# Altium schematic sheet FishTalk_Schematic.SchDoc
size A4; SheetNumber: 1; SheetTotal: 1
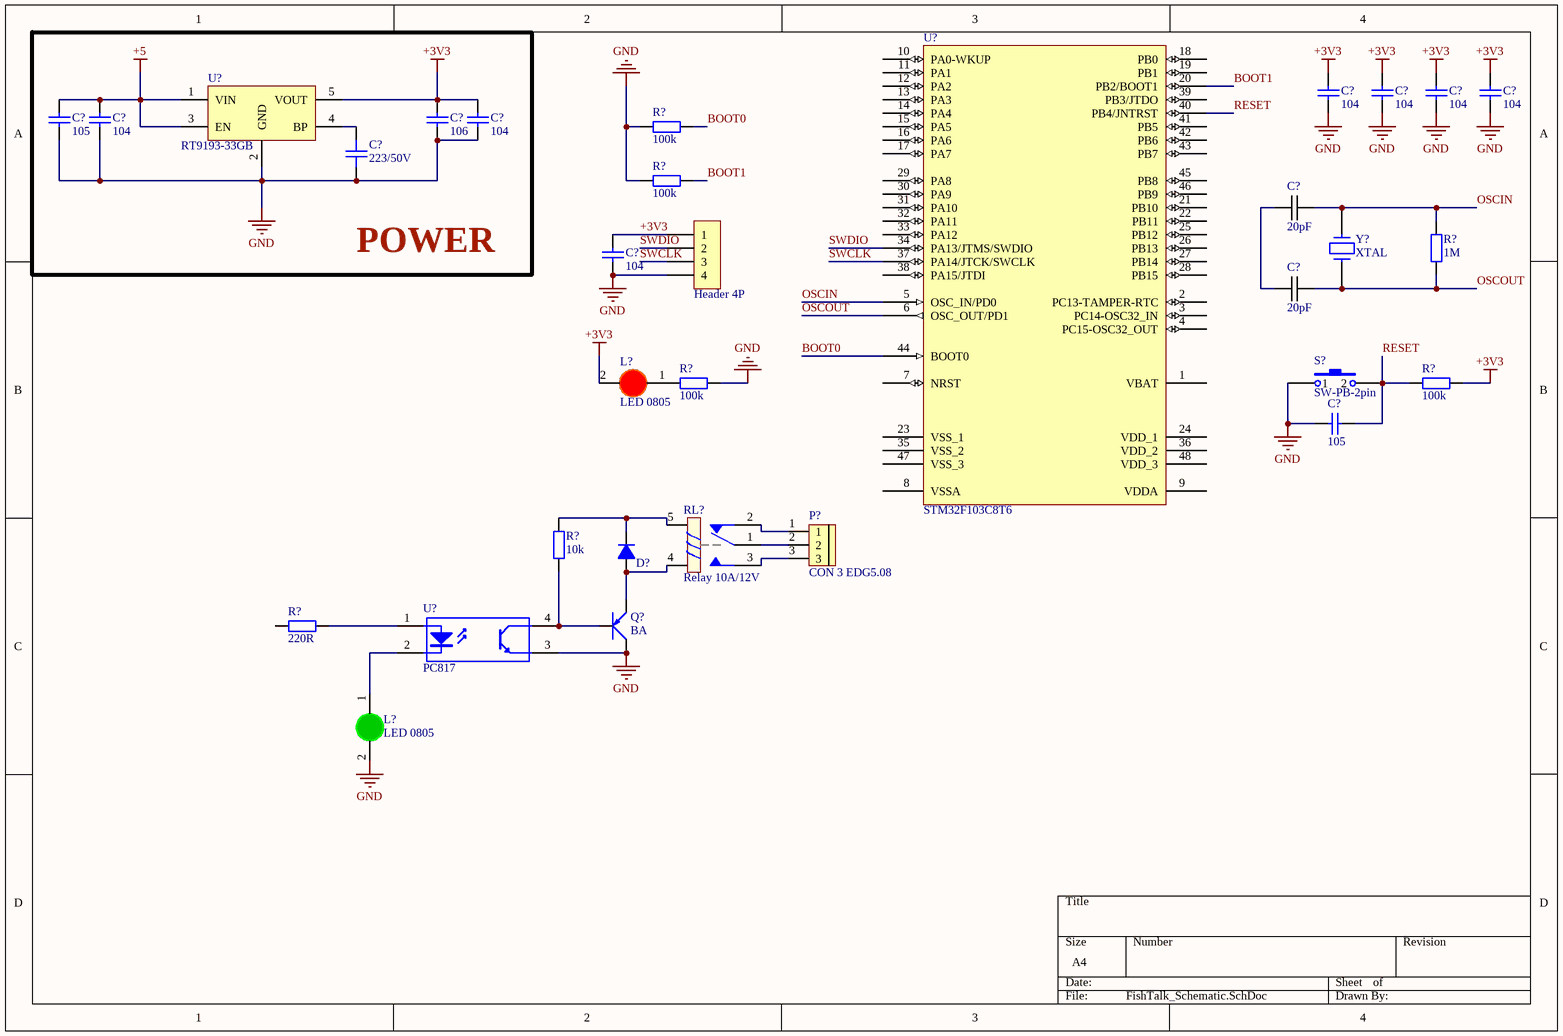
[diagram p0: FishTalk_Schematic.SchDoc]

## Parts
(Parts that share a designator on the sheet are numbered #1, #2 ... from top to bottom, then left to right.)
C?#1  104  [tu 0603]
C?#2  104  [tu 0603]
C?#3  104  [tu 0603]
C?#4  104  [tu 0603]
C?#5  105  [tu 0805]
C?#6  104  [tu 0603]
C?#7  106  [tu 0805]
C?#8  104  [tu 0603]
C?#9  223/50V  [CAPC-0603 (1608)]
C?#10  20pF  [0603C-GENERIC]
C?#11  104  [tu 0603]
C?#12  20pF  [0603C-GENERIC]
C?#13  105  [tu 0805]
D?  Diode  1N4007  [DO-214AC]  (value not drawn)
H?  Header 4P  [XH2.54M-4]
L?#1  LED 0805  [LED-1206-Red]
L?#2  LED 0805  [LED-1206-Green]
P?  CON 3 EDG5.08  [Con 3 KF301 5.08]
Q?  BA  [SOT23]
R?#1  100k  [tro smd 0603]
R?#2  100k  [tro smd 0603]
R?#3  1M  [tro smd 0603]
R?#4  100k  [tro smd 0603]
R?#5  100k  [tro smd 0603]
R?#6  10k  [tro smd 0603]
R?#7  220R  [tro smd 0603]
RL?  Relay 10A/12V  [RL_SPDT_10A]
S?  SW-PB-2pin  [SW_B3U-1000P]
U?#1  STM32F103C8T6  [LQFP48_L]
U?#2  RT9193-33GB  [SOT23-5AL]
U?#3  PC817  [PhotoCoupler_SMD]
Y?  XTAL  [XTAL]

## Blocks framed on the sheet
POWER: C?#5-C?#9 U?#2

## Nets
+3V3: C?#1.1 C?#2.1 C?#3.1 C?#4.1 C?#7.1 C?#8.1 C?#11.1 H?.1 L?#1.2(K) R?#5.2 U?#2.5(VOUT)
+5: C?#5.1 C?#6.1 U?#2.1(VIN) U?#2.3(EN)
GND: C?#1.2 C?#2.2 C?#3.2 C?#4.2 C?#5.2 C?#6.2 C?#7.2 C?#8.2 C?#9.1 C?#11.2 C?#13.1 H?.4 L?#2.2(K) Q?.3(C) R?#1.1 R?#2.1 R?#4.2 S?.1 U?#2.2(GND) U?#3.3(E)
BOOT0: R?#1.2 U?#1.44(BOOT0)
BOOT1: R?#2.2 U?#1.20(PB2/BOOT1)
OSCIN: C?#10.2 R?#3.2 U?#1.5(OSC_IN/PD0) Y?.2
OSCOUT: C?#12.2 R?#3.1 U?#1.6(OSC_OUT/PD1) Y?.1
RESET: C?#13.2 R?#5.1 S?.2 U?#1.40(PB4/JNTRST)
SWCLK: H?.3 U?#1.37(PA14/JTCK/SWCLK)
SWDIO: H?.2 U?#1.34(PA13/JTMS/SWDIO)
NetC?#9_2: C?#9.2 U?#2.4(BP)
NetC?#10_1: C?#10.1 C?#12.1
NetD?_A: D?.A Q?.2(E) RL?.4
NetD?_K: D?.K R?#6.2 RL?.5
NetL?#1_1: L?#1.1(A) R?#4.1
NetL?#2_1: L?#2.1(A) U?#3.2(K)
NetP?_1: P?.1 RL?.2
NetP?_2: P?.2 RL?.1
NetP?_3: P?.3 RL?.3
NetQ?_1: Q?.1(B) R?#6.1 U?#3.4(C)
NetR?#7_2: R?#7.2 U?#3.1(A)

Not connected (* = marked no-connect by the designer): R?#7 1; U?#1 1(VBAT) 2(PC13-TAMPER-RTC) 3(PC14-OSC32_IN) 4(PC15-OSC32_OUT) 7(NRST) 8(VSSA) 9(VDDA) 10(PA0-WKUP) 11(PA1) 12(PA2) 13(PA3) 14(PA4) 15(PA5) 16(PA6) 17(PA7) 18(PB0) 19(PB1) 21(PB10) 22(PB11) 23(VSS_1) 24(VDD_1) 25(PB12) 26(PB13) 27(PB14) 28(PB15) 29(PA8) 30(PA9) 31(PA10) 32(PA11) 33(PA12) 35(VSS_2) 36(VDD_2) 38(PA15/JTDI) 39(PB3/JTDO) 41(PB5) 42(PB6) 43(PB7) 45(PB8) 46(PB9) 47(VSS_3) 48(VDD_3)

## Library data of the parts
C?#1-C?#4 C?#6 C?#8 C?#11 = Tu 0603 104 50V 10%: Dán; Don_Vi: Con; So_Chan: 2; Ten_Linh_Kien: Tụ 0603 104-100nF 10% 50V; Ma_Hang: MH004568; Chung_Loai: Dán; Kieu_Chan: *
C?#5 C?#13 = Tu 0805 105 50V 10%: Dán; Don_Vi: Con; So_Chan: 2; Ten_Linh_Kien: Tụ 0805 105-1uF 10% 50V; Ma_Hang: MH004552; Chung_Loai: Dán; Kieu_Chan: *
C?#7 = Tu 0805 106 16V 10%: Dán; Ten_Linh_Kien: Tụ 0805 106-10uF 10% 16V; So_Chan: 2; Don_Vi: Con; Ma_Hang: MH004553; Chung_Loai: Dán; Kieu_Chan: *
C?#9 = CC0603JRX7R9BB223: CAP CER 0.022uF 5% 50V X7R 0603; Solder: SMT; CompanyID: VT-00673; MPN: CC0603JRX7R9BB223; Value: 223/50V; Category: CAPACITOR; PinCount: 2
C?#10 C?#12 = 0603C-220PF-50V-C0G-MUR: CAPACITOR 0603 CERAMIC; Manufacturer: Murata Electronics North America; Manufacturer Part Number: GRM1885C1H221JA01D; Reel: C15; Tolerance: ±5%; Capacitance: 220pF; Temperature Coefficient: C0G, NP0; Voltage - Rated: 50V; Supplier 1: Digi-Key; RoHS: RoHS Compliant; Lead Spacing: -; Supplier: Digi-Key; Features: General Purpose; Package / Case: 0603 (1608 metric); Packaging: Tape & Reel (TR); Operating Temperature: -55°C ~ 125°C; Category: Capacitors; Thickness: 0.80mm; Mounting Type: Surface Mount, MLCC; Supplier Part Number 1: 490-1435-2-ND; Supplier Part Number: 490-1435-2-ND
D? = Diode  1N4007: Diode 1A; Value: 1N4007
H? = Header 4P 2.54 Duc Thang: Cắm; Ten_Linh_Kien: Header 4P XH2.54-4P Đực Thẳng; Don_Vi: Con; Ma_Hang: MH001285; Chung_Loai: Cắm
L?#1 = LED 1206 Do: Dán; Don_Vi: Con; Ma_Hang: MH002334; Ten_Linh_Kien: LED1206 Màu Đỏ (Red); Ghi_Chu: *; Kieu_Chan: *; Chung_Loai: Dán
L?#2 = LED 1206 Xanh La: Dán; Don_Vi: Con; Ma_Hang: MH002947; Ten_Linh_Kien: LED1206 Màu Xanh Lá (Green); Ghi_Chu: *; Kieu_Chan: *; Chung_Loai: Dán
P? = CON 3 EDG5.08: Cắm; Ten_Linh_Kien: CON 3 2EDG5.08-3P 5.08MM ( Xanh Cong); Ma_Hang: MH000760; Ghi_Chu: *; Kieu_Chan: *; Don_Vi: Con; Chung_Loai: Cắm
Q? = A1015 BA SMD: PNP 600mW, ECB
R?#1 R?#2 R?#4 R?#5 = Tro 0603 5% 100k: Dán; So_Chan: 2; Ten_Linh_Kien: Trở 0603 5% 100k; Ma_Hang: MH006314; Don_Vi: Con; Chung_Loai: Dán; Kieu_Chan: *
R?#3 = Tro 0603 5% 1M: Dán; Don_Vi: Con; So_Chan: 2; Ten_Linh_Kien: Trở 0603 5% 1M; Ma_Hang: MH006909; Chung_Loai: Dán; Kieu_Chan: *
R?#6 = Tro 0603 1% 10k: Dán; Don_Vi: Con; So_Chan: 2; Ten_Linh_Kien: Trở 0603 1% 10k; Ma_Hang: MH006333; Chung_Loai: Dán; Kieu_Chan: *
R?#7 = Tro 0603 5% 220R: Dán; Don_Vi: Con; So_Chan: 2; Ten_Linh_Kien: Trở 0603 5% 220R; Ma_Hang: MH006322; Chung_Loai: Dán; Kieu_Chan: *
RL? = Relay 1: Relay SPDT,10A - 12VDC 5 Pin; Value: Relay SPDT, 10A, 12V
S? = SW-PB-2pin: Switch; Published: 24-Mar-1999; LatestRevisionDate: 17-Jul-2002; LatestRevisionNote: Re-released for DXP Platform.; PackageReference: SPST-2; Publisher: Altium Limited
U?#1 = STM32F103C8T6: STM32 ARM-based 32-bit MCU with 64 Kbytes Flash, 48-pin LQFP, Industrial Temperature; Published: 30-May-2008; DatasheetVersion: rev6, Mar-2008; PackageVersion: Mar-2008; PackageReference: LQFP48; Publisher: Altium Limited; PackageDescription: 48-Pin Low-Profile Quad Flat Pack, 7 x 7 mm Body, 0.5 mm Pitch (LQFP48); ComponentLink1Description: Manufacturer Link; ComponentLink1URL: www.st.com/stm32; ComponentLink2Description: Datasheet; ComponentLink2URL: http://www.st.com/stonline/products/literature/ds/13587.pdf
U?#2 = RT9193: 1A Regulator
U?#3 = PC817: 4-Pin Phototransistor Optocoupler; Published: 24-Mar-1999; LatestRevisionDate: 04-Mar-2005; LatestRevisionNote: Sch pins 3 & 4 Swapped.; DatasheetVersion: Nov-2003; PackageReference: DIP-4; Publisher: Altium Limited
Y? = XTAL: Crystal